# EAGLE design esp8266 (EAGLE 9.6.2)
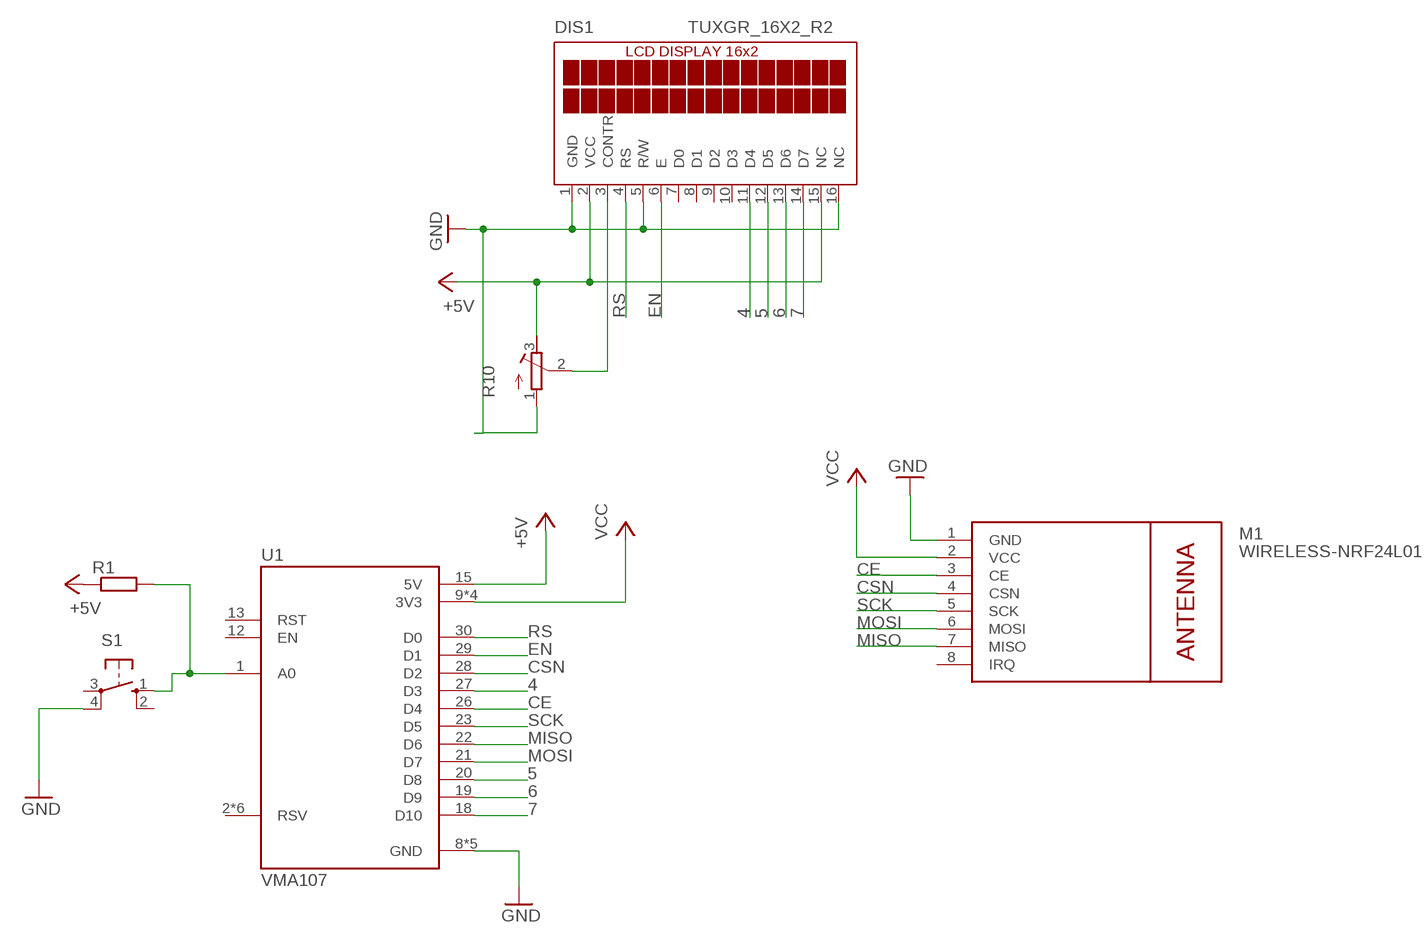
[diagram p0: schematic, sheet 1]

## Parts
DIS1  TUXGR_16X2_R2  [TUXGR_16X2_R2]
M1  WIRELESS-NRF24L01  [WIRELESS-NRF24L01]
R1  R-EU_0207/7  [0207/7]
R10  R-TRIMM3339P  [RTRIM3339P]
S1  10-XX  [B3F-10XX]
U1  VMA107  [MODULE_VMA107]

## Nets
4: DIS1.11(D4) U1.27(D3)
5: DIS1.12(D5) U1.20(D8)
6: DIS1.13(D6) U1.19(D9)
7: DIS1.14(D7) U1.18(D10)
+5V: DIS1.2(VCC) DIS1.15(NC) R1.1 R10.3(E) U1.15(5V)
CE: M1.3(CE) U1.26(D4)
CSN: M1.4(CSN) U1.28(D2)
EN: DIS1.6(E) U1.29(D1)
GND: DIS1.1(GND) DIS1.5(R/W) DIS1.16(NC) M1.1(GND) R10.1(A) S1.4(P1) U1.8(GND) U1.10(GND) U1.14(GND) U1.17(GND) U1.24(GND)
MISO: M1.7(MISO) U1.22(D6)
MOSI: M1.6(MOSI) U1.21(D7)
N$1: DIS1.3(CONTR) R10.2(S)
N$2: R1.2 S1.1(S) U1.1(A0)
RS: DIS1.4(RS) U1.30(D0)
SCK: M1.5(SCK) U1.23(D5)
VCC: M1.2(VCC) U1.9(3V3) U1.11(3V3) U1.16(3V3) U1.25(3V3)
Unconnected: DIS1.7(D0) DIS1.8(D1) DIS1.9(D2) DIS1.10(D3) M1.8(IRQ) S1.2(S1) S1.3(P) U1.2(RSV) U1.3(RSV) U1.4(RSV) U1.5(RSV) U1.6(RSV) U1.7(RSV) U1.12(EN) U1.13(RST)

## Library data of the parts
DIS1 = display-lcd:TUXGR_16X2_R2: Tuxgraphics LCD display 16x2 characters reflective, without background light Source: tuxgr_12x2_r2.pdf; OC_FARNELL: unknown; OC_NEWARK: unknown
M1 = diy-modules:WIRELESS-NRF24L01: 2.4 GHz Wireless Module based on NRF24L01 chip More details available here: http://www.electrodragon.com/w/NRF24L01 Click here to find device on ebay.com <http://www.ebay.com/sch/nrf24l01+arduino>
R1 = rcl:R-EU_: RESISTOR, European symbol; SPICEPREFIX: R
R10 = rcl:R-TRIMM: Trimm resistor; SPICEMODEL: X; SPICEPREFIXL: POT
S1 = switch-omron:10-XX: OMRON SWITCH; MPN: B3F-1000; OC_FARNELL: 176432; OC_NEWARK: 36M3542
U1 = VMA107:VMA107: NodeMCU V2 Lua Based ESP8266 Development Board Check availability <https://pricing.snapeda.com/parts/VMA107/Velleman/view-part?ref=eda>; AVAILABILITY: Not in stock; DESCRIPTION: NodeMCU V2 Lua Based ESP8266 Development Board; MF: Velleman; MP: VMA107; PACKAGE: None; PRICE: None

## Board
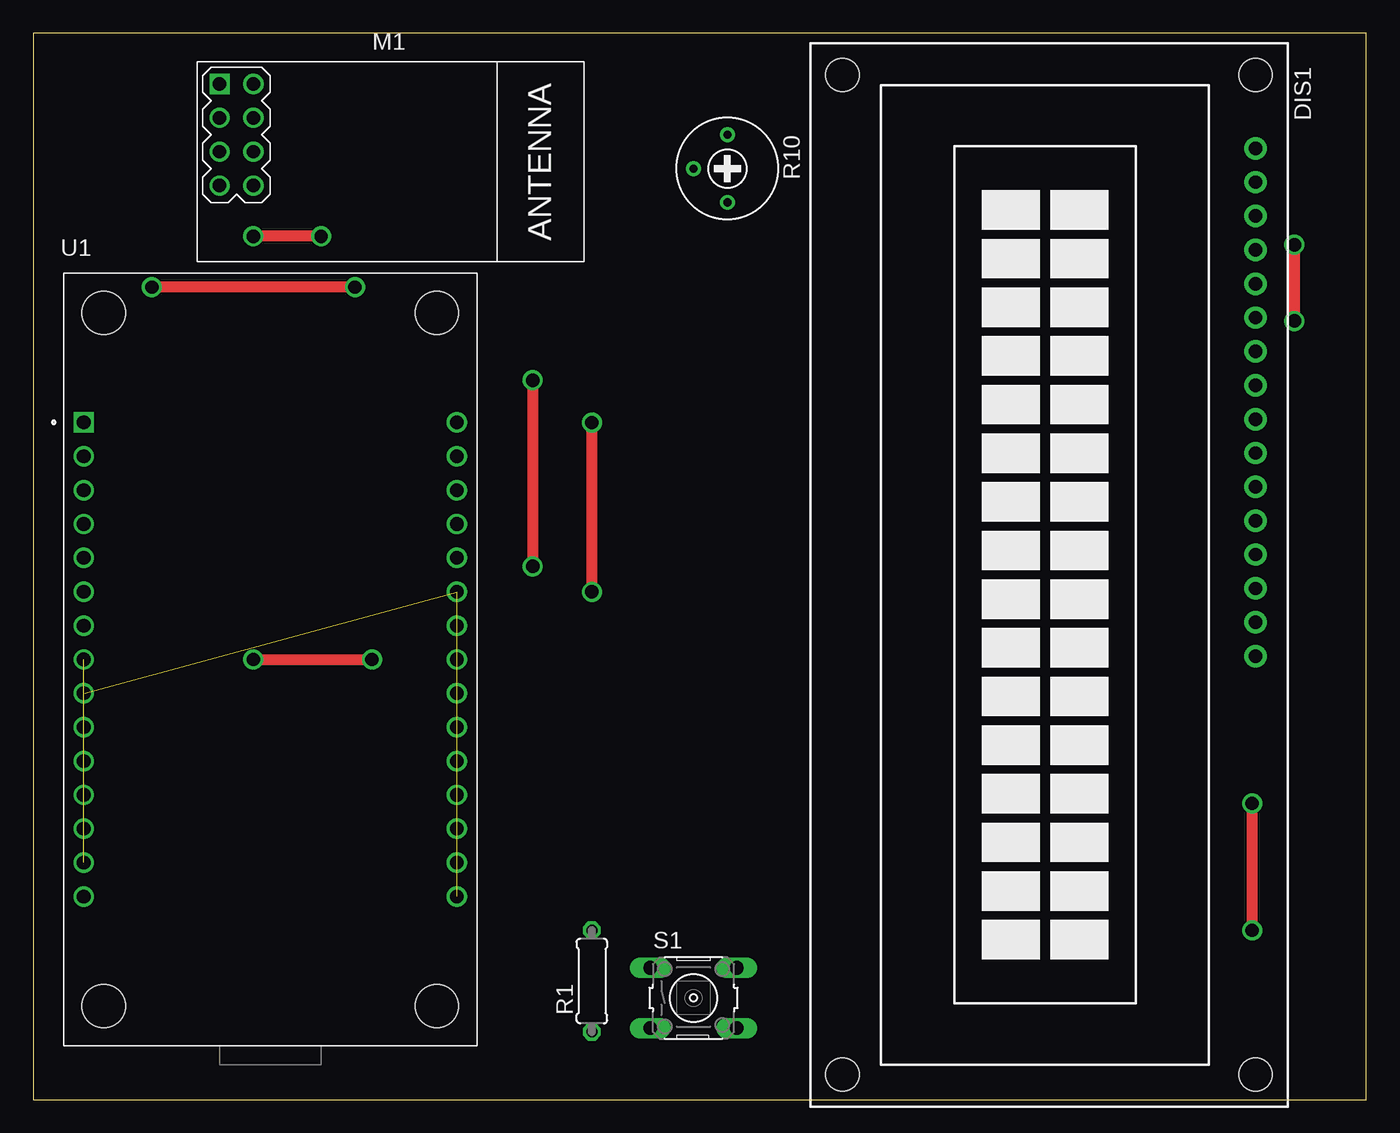
[diagram p1: board, top side]
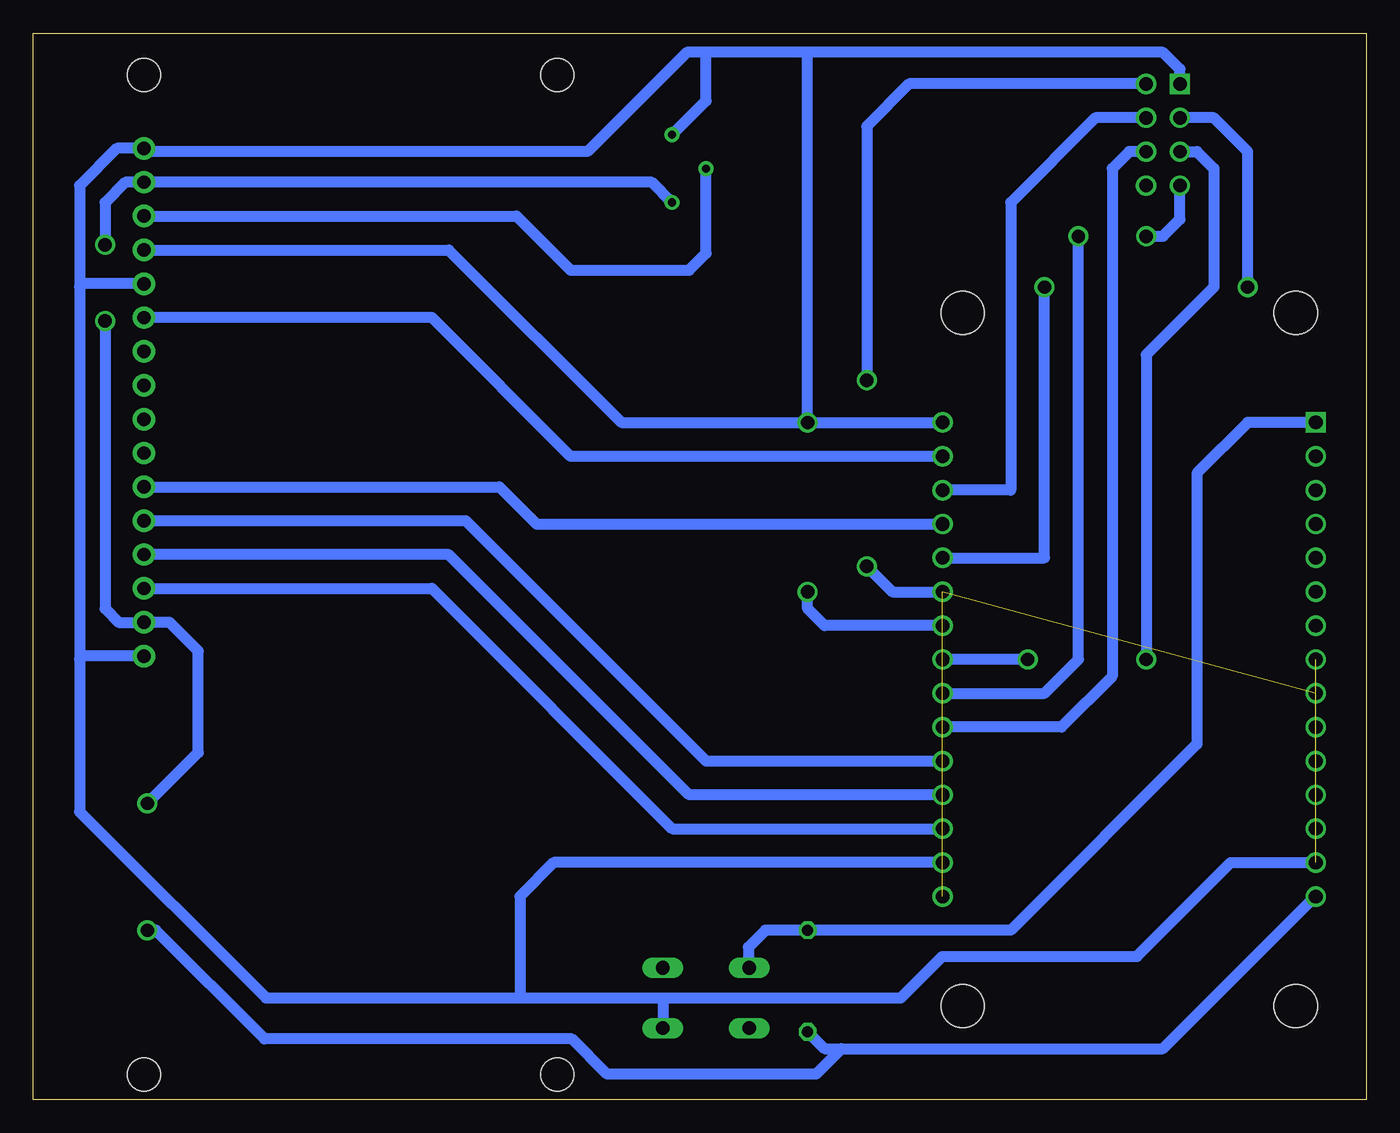
[diagram p2: board, bottom side, seen from below]

Size 100 x 80 mm. Coordinates in mm from the lower left corner, seen from the top.
Outline: 0,0 100,0 100,80 0,80 0,0
Copper layers (1*16): Top 0.035mm / dielectric 1.5mm / Bottom 0.035mm
Design rules "default": minimum track width 6mil, minimum drill 0.35mm, track to track 6mil, track to pad 6mil, pad to pad 6mil, via to via 6mil, smd to smd 6mil, copper to edge 40mil, drill to drill 6mil, minimum pad ring 10mil, minimum via ring 8mil, stop-mask expansion 4mil, vias tented up to drill 0mil, thermal gap 10mil

### Footprints (pad centres in the part's own frame; a part is rotated, then mirrored left to right if it is on the bottom)
TUXGR_16X2_R2 = drill 1 pad 1.676: 1 -32,15.5; 2 -29.46,15.5; 3 -26.92,15.5; 4 -24.38,15.5; 5 -21.84,15.5; 6 -19.3,15.5; 7 -16.76,15.5; 8 -14.22,15.5; 9 -11.68,15.5; 10 -9.14,15.5; 11 -6.6,15.5; 12 -4.06,15.5; 13 -1.52,15.5; 14 1.02,15.5; 15 3.56,15.5; 16 6.1,15.5 | hole 2.5: -37.5,-15.5; 37.5,-15.5; -37.5,15.5; 37.5,15.5
WIRELESS-NRF24L01 = drill 1 square: 1 -12.7,6.35 | drill 1: 2 -10.16,6.35; 3 -12.7,3.81; 4 -10.16,3.81; 5 -12.7,1.27; 6 -10.16,1.27; 7 -12.7,-1.27; 8 -10.16,-1.27
0207/7 = drill 0.813 octagon: 1 -3.81,0; 2 3.81,0
RTRIM3339P = drill 0.61: 1 -2.54,0; 2 0,-2.54; 3 2.54,0
B3F-10XX = drill 1.016 long: 1 -3.251,2.261; 2 3.251,2.261; 3 -3.251,-2.261; 4 3.251,-2.261
MODULE_VMA107 = drill 1.02 square: 1 -14,17.78 | drill 1.02: 2 -14,15.24; 3 -14,12.7; 4 -14,10.16; 5 -14,7.62; 6 -14,5.08; 7 -14,2.54; 8 -14,0; 9 -14,-2.54; 10 -14,-5.08; 11 -14,-7.62; 12 -14,-10.16; 13 -14,-12.7; 14 -14,-15.24; 15 -14,-17.78; 16 14,-17.78; 17 14,-15.24; 18 14,-12.7; 19 14,-10.16; 20 14,-7.62; 21 14,-5.08; 22 14,-2.54; 23 14,0; 24 14,2.54; 25 14,5.08; 26 14,7.62; 27 14,10.16; 28 14,12.7; 29 14,15.24; 30 14,17.78 | hole 3.25: -12.5,-26; -12.5,26; 12.5,26; 12.5,-26

### Placement (x,y rotation side)
DIS1  76.2,39.37 270 top
M1  26.67,69.85 0 top
R1  41.91,8.89 90 top
R10  52.07,69.85 270 top
S1  49.53,7.62 0 top
U1  17.78,33.02 0 top

### Tracks (layer width: path | path; a pad name or v marks a point on that pad's centre or on a via)
4
  Bottom 0.813: DIS1.11 65.02,45.97 62.23,43.18 U1.27
5
  Bottom 0.813: DIS1.12 67.56,43.43 49.53,25.4 U1.20 31.75,25.4
6
  Bottom 0.813: U1.19 50.8,22.86 68.83,40.89 DIS1.13
7
  Bottom 0.813: DIS1.14 70.1,38.35 52.07,20.32 U1.18
+5V  (via drill 1)
  Top 0.813: v91.44,12.7 v91.44,22.23 | v94.61,64.14 v94.61,58.42
  Bottom 0.813: R10.3 53.59,68.83 DIS1.2 93.09,68.83 94.61,67.31 v94.61,64.14 | R1.1 40.64,3.81 39.37,3.81 | 39.37,3.81 15.24,3.81 3.81,15.24 U1.15 | 39.37,3.81 41.27,1.91 56.96,1.91 59.59,4.54 82.65,4.54 90.81,12.7 v91.44,12.7 | v91.44,22.23 87.63,26.04 87.63,33.66 89.78,35.81 DIS1.15 93.59,35.81 94.61,36.83 v94.61,58.42
CE  (via drill 1)
  Top 0.813: v24.13,60.96 v8.89,60.96
  Bottom 0.813: U1.26 24.13,40.64 v24.13,60.96 | v8.89,60.96 8.89,71.12 11.43,73.66 M1.3
CSN
  Bottom 0.813: M1.4 20.32,73.66 26.67,67.31 26.67,45.72 U1.28
EN
  Bottom 0.813: U1.29 59.69,48.26 70.1,58.67 DIS1.6
GND  (via drill 1)  (2 unrouted)
  Top 0.813: v41.91,38.1 v41.91,50.8
  Bottom 0.813: M1.1 13.97,77.31 15.24,78.58 41.91,78.58 | 41.91,78.58 49.53,78.58 | 49.53,78.58 50.96,78.58 58.42,71.12 91.45,71.12 DIS1.1 93.73,71.37 96.52,68.58 96.52,60.96 | R10.1 49.53,74.93 49.53,78.58 | U1.24 40.64,35.56 41.91,36.83 v41.91,38.1 | v41.91,50.8 41.91,78.58 | 96.52,60.96 96.52,33.02 | 96.52,33.02 96.52,21.59 82.55,7.62 63.5,7.62 | U1.14 10.16,17.78 17.2,10.74 31.8,10.74 34.92,7.62 52.7,7.62 | 63.5,7.62 52.7,7.62 | U1.17 60.96,17.78 63.5,15.24 63.5,7.62 | S1.4 52.7,5.44 52.7,7.62 | DIS1.16 96.27,33.27 96.52,33.02 | DIS1.5 96.27,61.21 96.52,60.96
MISO  (via drill 1)
  Top 0.813: v21.59,64.77 v16.51,64.77
  Bottom 0.813: U1.22 24.13,30.48 21.59,33.02 v21.59,64.77 | v16.51,64.77 15.24,64.77 13.97,66.04 M1.7
MOSI
  Bottom 0.813: M1.6 17.78,71.12 19.05,69.85 19.05,31.75 22.86,27.94 U1.21
N$1
  Bottom 0.813: DIS1.3 63.75,66.29 59.69,62.23 50.8,62.23 49.53,63.5 R10.2
N$2
  Bottom 0.813: U1.1 8.89,50.8 12.7,46.99 12.7,26.67 26.67,12.7 R1.2 45.09,12.7 46.35,11.43 46.35,9.96 S1.1
RS
  Bottom 0.813: DIS1.4 68.83,63.75 55.88,50.8 U1.30
SCK  (via drill 1)
  Top 0.813: v16.51,33.02 v25.4,33.02
  Bottom 0.813: M1.5 12.7,71.12 11.43,69.85 11.43,60.96 16.51,55.88 v16.51,33.02 | v25.4,33.02 U1.23
VCC  (via drill 1)  (3 unrouted)
  Top 0.813: v37.47,53.98 v37.47,40.01
  Bottom 0.813: M1.2 34.29,76.2 37.47,73.03 v37.47,53.98 | v37.47,40.01 35.56,38.1 U1.25